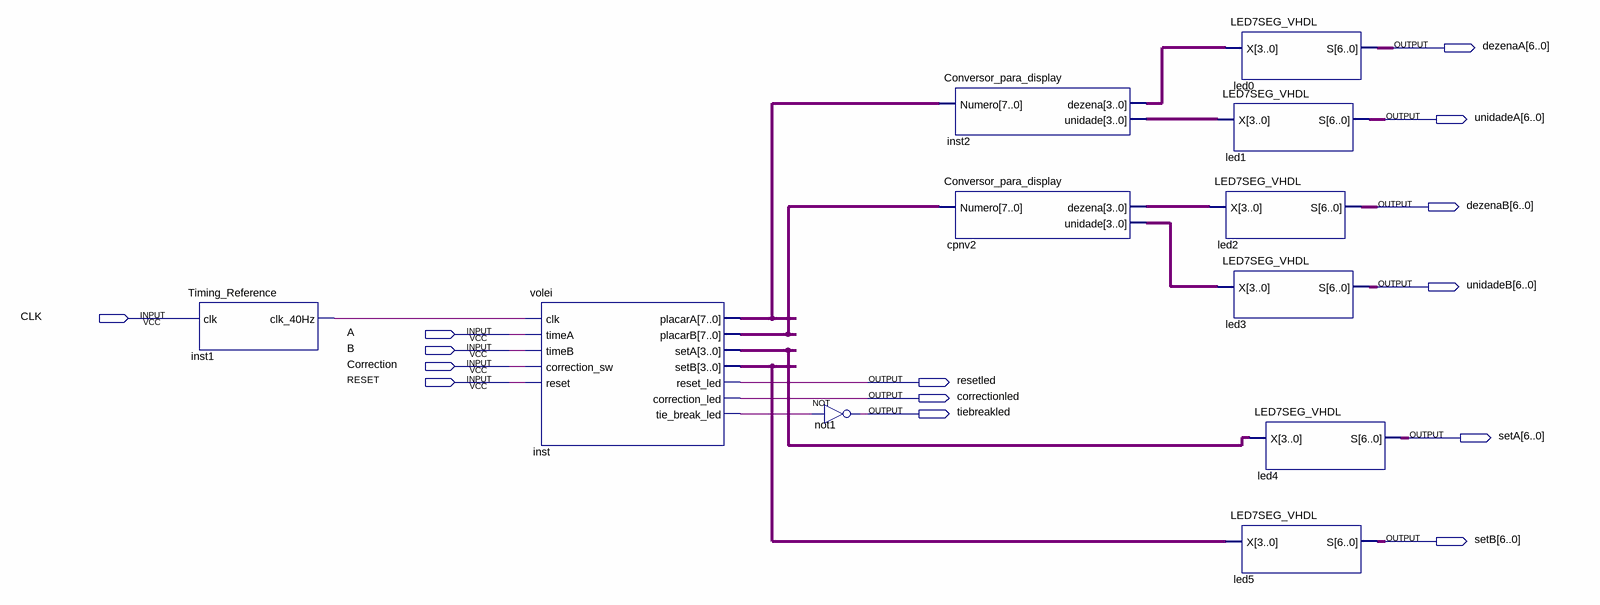
[diagram p0: schematic sheet]
// Quartus schematic arquivotopo.bdf as structural Verilog: 11 symbols, 14 pins
module arquivotopo (
  input  CLK,
  input  A,
  input  B,
  input  Correction,
  input  RESET,
  output [6:0] dezenaA,
  output [6:0] unidadeA,
  output [6:0] dezenaB,
  output [6:0] unidadeB,
  output resetled,
  output correctionled,
  output tiebreakled,
  output [6:0] setA,
  output [6:0] setB
);

  wire inst1_clk_40hz, inst_tie_break_led;
  wire [3:0] cpnv2_dezena, cpnv2_unidade, inst2_dezena, inst2_unidade, inst_seta, inst_setb;
  wire [7:0] inst_placara, inst_placarb;

  Timing_Reference inst1 (.clk(CLK), .clk_40Hz(inst1_clk_40hz));
  volei inst (
    .clk(inst1_clk_40hz), .timeA(A), .timeB(B), .correction_sw(Correction), .reset(RESET),
    .placarA(inst_placara), .placarB(inst_placarb), .setA(inst_seta), .setB(inst_setb), .reset_led(resetled),
    .correction_led(correctionled), .tie_break_led(inst_tie_break_led));
  not not1 (tiebreakled, inst_tie_break_led);
  Conversor_para_display inst2 (.Numero(inst_placara), .dezena(inst2_dezena), .unidade(inst2_unidade));
  Conversor_para_display cpnv2 (.Numero(inst_placarb), .dezena(cpnv2_dezena), .unidade(cpnv2_unidade));
  LED7SEG_VHDL led0 (.X(inst2_dezena), .S(dezenaA));
  LED7SEG_VHDL led1 (.X(inst2_unidade), .S(unidadeA));
  LED7SEG_VHDL led2 (.X(cpnv2_dezena), .S(dezenaB));
  LED7SEG_VHDL led3 (.X(cpnv2_unidade), .S(unidadeB));
  LED7SEG_VHDL led5 (.X(inst_setb), .S(setB));
  LED7SEG_VHDL led4 (.X(inst_seta), .S(setA));
endmodule
